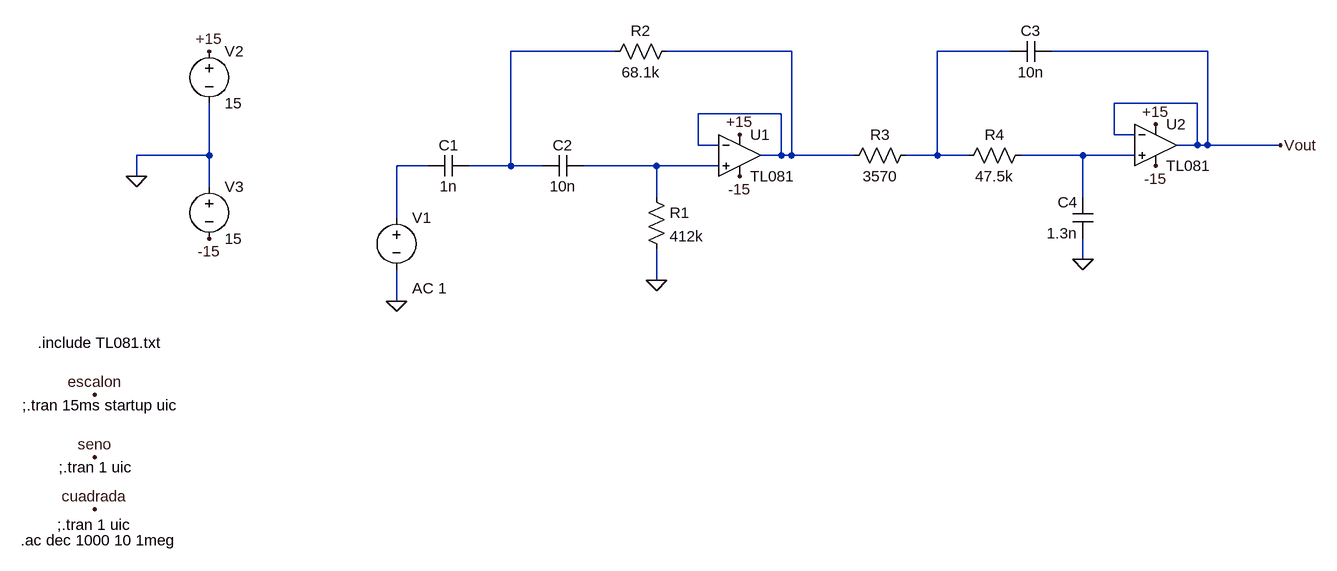
[diagram p0: schematic tp.asc]
tp.asc, the LTspice schematic file:
Version 4
SHEET 1 1128 688
WIRE 32 -80 -128 -80
WIRE 304 -80 112 -80
WIRE 640 -80 528 -80
WIRE 944 -80 704 -80
WIRE 928 0 800 0
WIRE 288 16 160 16
WIRE 800 48 800 0
WIRE 832 48 800 48
WIRE 160 64 160 16
WIRE 192 64 160 64
WIRE 928 64 928 0
WIRE 928 64 896 64
WIRE 944 64 944 -80
WIRE 944 64 928 64
WIRE 1056 64 944 64
WIRE -592 80 -592 0
WIRE -592 80 -704 80
WIRE 288 80 288 16
WIRE 288 80 256 80
WIRE 304 80 304 -80
WIRE 304 80 288 80
WIRE 400 80 304 80
WIRE 528 80 528 -80
WIRE 528 80 480 80
WIRE 576 80 528 80
WIRE 752 80 656 80
WIRE 832 80 752 80
WIRE -256 96 -304 96
WIRE -128 96 -128 -80
WIRE -128 96 -192 96
WIRE -80 96 -128 96
WIRE 96 96 -16 96
WIRE 192 96 96 96
WIRE -704 112 -704 80
WIRE -592 128 -592 80
WIRE 96 144 96 96
WIRE 752 144 752 80
WIRE -304 176 -304 96
WIRE 752 240 752 208
WIRE 96 272 96 224
WIRE -304 304 -304 256
FLAG 96 272 0
FLAG 752 240 0
FLAG -304 304 0
FLAG -704 112 0
FLAG 1056 64 Vout
FLAG -592 -80 +15
FLAG -592 208 -15
FLAG 224 112 -15
FLAG 864 96 -15
FLAG 224 48 +15
FLAG 864 32 +15
FLAG -768 448 escalon
FLAG -768 544 seno
FLAG -768 624 cuadrada
SYMBOL res 80 128 R0
SYMATTR InstName R1
SYMATTR Value 412k
SYMBOL cap -192 80 R90
WINDOW 0 0 32 VBottom 2
WINDOW 3 32 32 VTop 2
SYMATTR InstName C1
SYMATTR Value 1n
SYMBOL cap -16 80 R90
WINDOW 0 0 32 VBottom 2
WINDOW 3 32 32 VTop 2
SYMATTR InstName C2
SYMATTR Value 10n
SYMBOL res 128 -96 R90
WINDOW 0 0 56 VBottom 2
WINDOW 3 32 56 VTop 2
SYMATTR InstName R2
SYMATTR Value 68.1k
SYMBOL OpAmps\\opamp2 224 16 R0
SYMATTR InstName U1
SYMATTR Value TL081
SYMBOL res 496 64 R90
WINDOW 0 0 56 VBottom 2
WINDOW 3 32 56 VTop 2
SYMATTR InstName R3
SYMATTR Value 3570
SYMBOL res 672 64 R90
WINDOW 0 0 56 VBottom 2
WINDOW 3 32 56 VTop 2
SYMATTR InstName R4
SYMATTR Value 47.5k
SYMBOL cap 704 -96 R90
WINDOW 0 0 32 VBottom 2
WINDOW 3 32 32 VTop 2
SYMATTR InstName C3
SYMATTR Value 10n
SYMBOL cap 768 208 R180
WINDOW 0 24 56 Left 2
WINDOW 3 24 8 Left 2
SYMATTR InstName C4
SYMATTR Value 1.3n
SYMBOL OpAmps\\opamp2 864 0 R0
SYMATTR InstName U2
SYMATTR Value TL081
SYMBOL voltage -304 160 R0
WINDOW 123 24 124 Left 2
WINDOW 39 0 0 Left 0
SYMATTR Value2 AC 1
SYMATTR InstName V1
SYMATTR Value ""
SYMBOL voltage -592 -96 R0
WINDOW 123 0 0 Left 0
WINDOW 39 0 0 Left 0
SYMATTR InstName V2
SYMATTR Value 15
SYMBOL voltage -592 112 R0
WINDOW 123 0 0 Left 0
WINDOW 39 0 0 Left 0
SYMATTR InstName V3
SYMATTR Value 15
TEXT -856 368 Left 2 !.include TL081.txt
TEXT -880 464 Left 2 !;.tran 15ms startup uic
TEXT -824 560 Left 2 !;.tran 1 uic
TEXT -826 648 Left 2 !;.tran 1 uic
TEXT -882 672 Left 2 !.ac dec 1000 10 1meg

The netlist it stands for:
* tp.asc
R1 N006 0 412k
C1 N001 N005 1n
C2 N006 N001 10n
R2 N002 N001 68.1k
XU1 N006 N002 +15 -15 N002 TL081  ; pins In+ In- V+ V- OUT
R3 N003 N002 3570
R4 N004 N003 47.5k
C3 Vout N003 10n
C4 0 N004 1.3n
XU2 N004 Vout +15 -15 Vout TL081  ; pins In+ In- V+ V- OUT
V1 N005 0 AC 1
V2 +15 0 15
V3 0 -15 15
.include TL081.txt
;.tran 15ms startup uic
;.tran 1 uic
;.tran 1 uic
.ac dec 1000 10 1meg
.backanno
.end